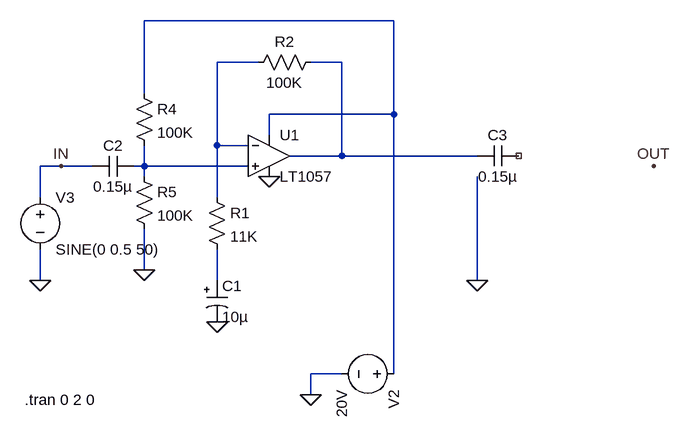
[diagram p0: schematic OpAmpSingle.asc]
OpAmpSingle.asc, the LTspice schematic file:
Version 4
SHEET 1 880 680
WIRE 352 -192 -32 -192
WIRE 144 -128 80 -128
WIRE 272 -128 224 -128
WIRE -32 -80 -32 -192
WIRE 352 -48 352 -192
WIRE 352 -48 160 -48
WIRE 160 -16 160 -48
WIRE 80 0 80 -128
WIRE 128 0 80 0
WIRE 272 16 272 -128
WIRE 272 16 192 16
WIRE 480 16 272 16
WIRE -160 32 -192 32
WIRE -112 32 -160 32
WIRE -32 32 -32 0
WIRE -32 32 -48 32
WIRE 128 32 -32 32
WIRE -32 48 -32 32
WIRE -192 80 -192 32
WIRE 80 80 80 0
WIRE -32 192 -32 128
WIRE -192 208 -192 160
WIRE 80 208 80 160
WIRE 480 208 480 48
WIRE 272 352 224 352
WIRE 352 352 352 -48
WIRE 224 384 224 352
FLAG 752 32 OUT
FLAG -160 32 IN
FLAG -192 208 0
FLAG 480 208 0
FLAG -32 192 0
FLAG 224 384 0
FLAG 80 272 0
FLAG 160 48 0
SYMBOL res 64 64 R0
SYMATTR InstName R1
SYMATTR Value 11K
SYMATTR SpiceLine tol=1 pwr=0.1
SYMBOL res 240 -144 R90
WINDOW 0 0 56 VBottom 2
WINDOW 3 32 56 VTop 2
SYMATTR InstName R2
SYMATTR Value 100K
SYMATTR SpiceLine tol=1 pwr=0.1
SYMBOL voltage 368 352 R90
WINDOW 123 0 0 Left 2
WINDOW 39 0 0 Left 2
SYMATTR InstName V2
SYMATTR Value 20V
SYMBOL Opamps\\LT1057 160 -48 R0
SYMATTR InstName U1
SYMBOL voltage -192 64 R0
WINDOW 123 0 0 Left 2
WINDOW 39 0 0 Left 2
SYMATTR InstName V3
SYMATTR Value SINE(0 0.5 50)
SYMBOL res -48 -96 R0
SYMATTR InstName R4
SYMATTR Value 100K
SYMATTR SpiceLine tol=1 pwr=0.1
SYMBOL res -48 32 R0
SYMATTR InstName R5
SYMATTR Value 100K
SYMATTR SpiceLine tol=1 pwr=0.1
SYMBOL cap -48 16 R90
WINDOW 0 0 32 VBottom 2
WINDOW 3 32 32 VTop 2
SYMATTR InstName C2
SYMATTR Value 0.15µ
SYMATTR SpiceLine V=25 Irms=1.94 Rser=0.0650466 Lser=0 mfg="KEMET" pn="C0805C154K3RAC" type="X7R"
SYMBOL polcap 64 208 R0
WINDOW 3 24 56 Left 2
SYMATTR InstName C1
SYMATTR Value 10µ
SYMATTR Description Capacitor
SYMATTR Type cap
SYMATTR SpiceLine V=35 Irms=0 Rser=0.3 Lser=0 mfg="AVX" pn="TPSD106M035R0300" type="Tantalum"
SYMBOL cap 544 0 R90
WINDOW 0 0 32 VBottom 2
WINDOW 3 32 32 VTop 2
SYMATTR InstName C3
SYMATTR Value 0.15µ
SYMATTR SpiceLine V=25 Irms=1.94 Rser=0.0650466 Lser=0 mfg="KEMET" pn="C0805C154K3RAC" type="X7R"
TEXT -216 392 Left 2 !.tran 0 2 0

The netlist it stands for:
* OpAmpSingle.asc
R1 N002 N005 11K tol=1 pwr=0.1
R2 N003 N002 100K tol=1 pwr=0.1
V2 N001 0 20V
XU1 N004 N002 N001 0 N003 LT1057  ; pins In+ In- V+ V- OUT
V3 IN 0 SINE(0 0.5 50)
R4 N001 N004 100K tol=1 pwr=0.1
R5 N004 0 100K tol=1 pwr=0.1
C2 N004 IN 0.15µ V=25 Irms=1.94 Rser=0.0650466 Lser=0 mfg="KEMET" pn="C0805C154K3RAC" type="X7R"
C1 N005 0 10µ V=35 Irms=0 Rser=0.3 Lser=0 mfg="AVX" pn="TPSD106M035R0300" type="Tantalum"
C3 NC_01 N003 0.15µ V=25 Irms=1.94 Rser=0.0650466 Lser=0 mfg="KEMET" pn="C0805C154K3RAC" type="X7R"
.tran 0 2 0
.lib LTC.lib
.backanno
.end